# EasyEDA Pro project XIAO Board.eprj

# Schematic Schematic1
Board Name: Board1; Create Date: 2026-01-22; Page Name: P1; Project Name: XIAO Board; Schematic Name: Schematic1; Update Date: 2026-01-22; Company: EasyEDA.com; Page Size: A4; Version: V1.0
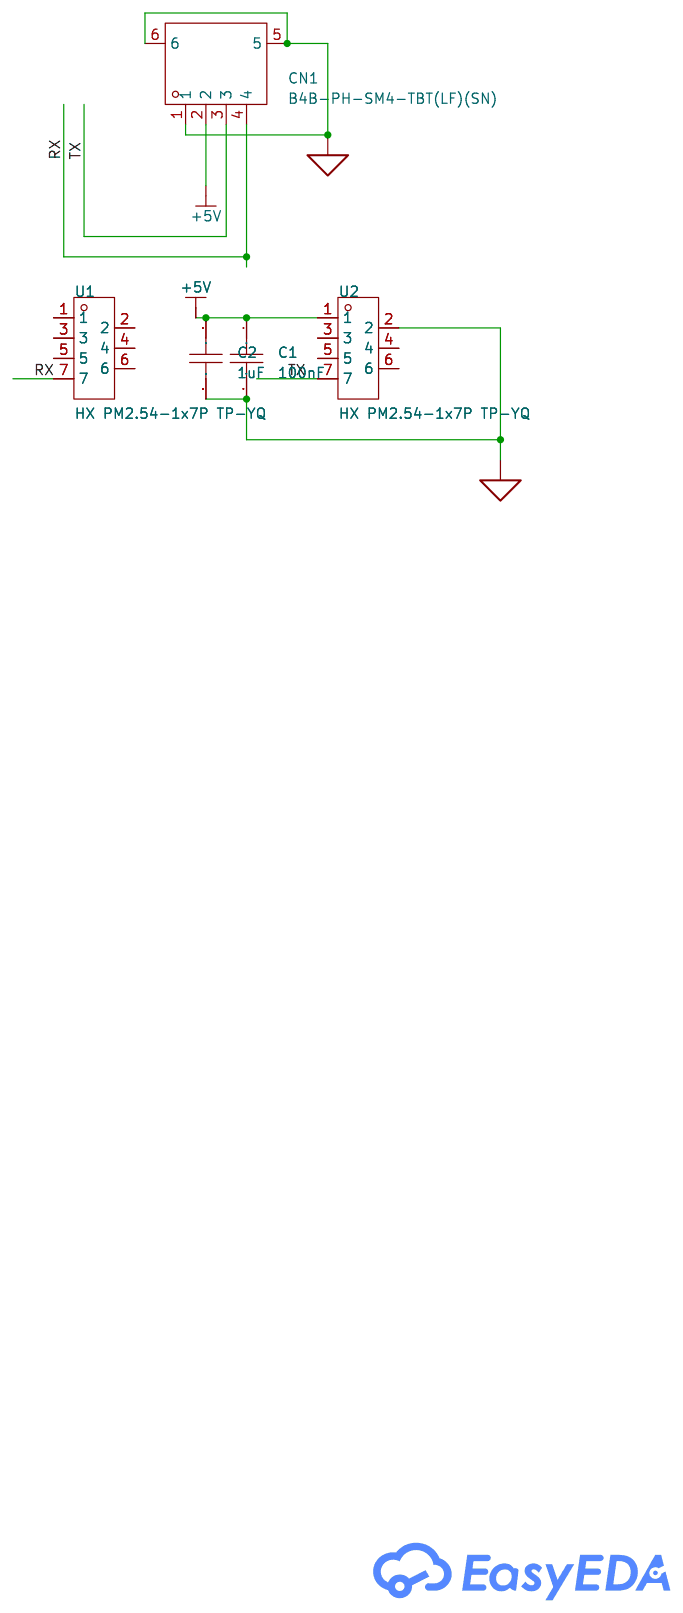
[diagram p0: schematic sheet]

## Parts
C1  100nF  [C0603]
C2  1uF  [C0603]
CN1  B4B-PH-SM4-TBT(LF)(SN)  [CONN-SMD_B4B-PH-SM4-TBT-LF-SN]
U1  HX PM2.54-1x7P TP-YQ  [HDR-SMD_7P-P2.54_HX-PM2.54-1X7P-TP-YQ]
U2  HX PM2.54-1x7P TP-YQ  [HDR-SMD_7P-P2.54_HX-PM2.54-1X7P-TP-YQ]

## Library data of the parts
C1 = CL10B104KB8NNNC: Capacitance:100nF Tolerance:±10% Tolerance:±10% Voltage Rating:50V Temperature Coefficient:X7R; LCSC Part Name: 100nF ±10% 50V; Supplier Part: C1591; Manufacturer: SAMSUNG(三星); Supplier Footprint: 0603; JLCPCB Part Class: Extended Part; Datasheet: https://item.szlcsc.com/datasheet/CL10B104KB8NNNC/1943.html; Supplier: LCSC; Tolerance: ±10%; Voltage Rating: 50V; Temperature Coefficient: X7R
C2 = CGA0603X5R105K500JT: Capacitance:1uF Tolerance:±10% Tolerance:±10% Voltage Rating:50V Temperature Coefficient:X5R; LCSC Part Name: 1uF ±10% 50V; Supplier Part: C6119852; Manufacturer: HRE(芯声); Supplier Footprint: 0603; JLCPCB Part Class: Extended Part; Datasheet: https://item.szlcsc.com/datasheet/CGA0603X5R105K500JT/7062558.html; Supplier: LCSC; Tolerance: ±10%; Voltage Rating: 50V; Temperature Coefficient: X5R
CN1 = B4B-PH-SM4-TBT(LF)(SN): LCSC Part Name: 1x4P 间距:2mm 立贴 系列:PH; Supplier Part: C265116; Manufacturer: JST; Supplier Footprint: SMD,P=2mm; JLCPCB Part Class: Extended Part; Datasheet: https://item.szlcsc.com/datasheet/B4B-PH-SM4-TBT(LF)(SN)/255487.html; Supplier: LCSC; Pins Structure: 1x4P; Pitch: 2mm; Mounting Type: Surface Mount,Vertical; Reference Series: PH; Number of Pins: 4P; Number of Rows: 1; Number of PINs Per Row: 4; Current Rating: 2A; Contact Material: Copper Alloy; Contact Plating: Tin; Operating Temperature: -25℃~+85℃; Voltage Rating: 100V; Plastic Material: PA; Flame Retardant Rating: UL94V-0; Supplementary Features: Auxiliary Solder Pin; Color: Beige; Z-Height of the Board: 6.6mm; X-Length of Bottom Edge on Board (Spacing Line): 11.95mm; Y-Width of Bottom Edge on Board: 7mm
U1 U2 = HX PM2.54-1x7P TP-YQ: LCSC Part Name: 1x7P 间距:2.54mm 立贴; Supplier Part: C42379199; Manufacturer: hanxia(韩下); Supplier Footprint: SMD,P=2.54mm(交错脚); JLCPCB Part Class: Extended Part; Datasheet: https://item.szlcsc.com/datasheet/HX%2520PM2.54-1x7P%2520TP-YQ/44285228.html; Supplier: LCSC; Holes Structure: 1x7P; Pitch: 2.54mm; Circular Hole / Square Hole: Square Hole; Mounting Type: Surface Mount,Vertical; Number of Rows: 1; Number of Positions: 7P; Current Rating: 3A; Voltage Rating (Max): 1kV; Holes Direction: Top; Insulation Height: 5mm; Contact Material: Brass; Contact Plating: Gold; Operating Temperature: -40℃~+105℃

## Nets
+5V: C1.1 C2.1 CN1.2 U2.1
GND: C1.2 C2.2 CN1.1 CN1.5 CN1.6 U2.2
RX: CN1.4 U1.7
TX: CN1.3 U2.7

Not connected (* = marked no-connect by the designer): U1 1 2 3 4 5 6; U2 3 4 5 6

# Board PCB1
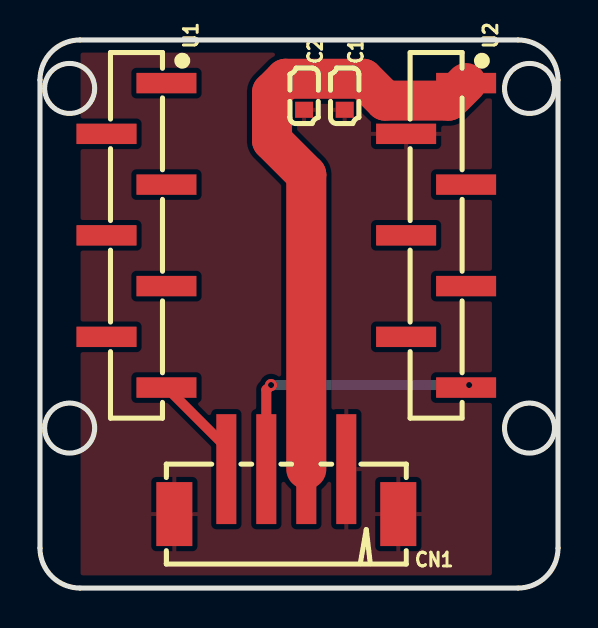
[diagram p1: board, top side]
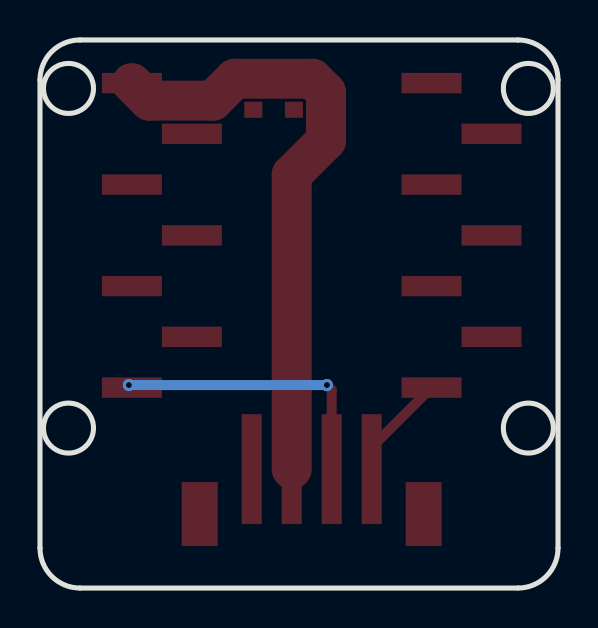
[diagram p2: board, bottom side, seen from below]

Outline 25.91 x 27.43 mm; copper layers: Top Layer, Bottom Layer. Coordinates in mm from the lower left corner of the outline.
Outline path: circle c1.48,25.01 r1.25 ; circle c1.48,8.01 r1.25 ; circle c24.48,25.01 r1.25 ; circle c24.48,8.01 r1.25 ; 0,25.43 0,2 arc(0.59,0.59) 2,0 23.91,0 arc(25.32,0.59) 25.91,2 25.91,25.43 arc(25.32,26.85) 23.91,27.43 2,27.43 arc(0.59,26.85) 0,25.43
Stack: Top Layer 0.035mm / Dielectric1 1.51mm FR4 er 4.5 / Bottom Layer 0.035mm

## Design rules (mm)
template: JLCPCB Capability(Two Layers Board)
spacing copperThickness1oz (default): track to track 0.102, other pairs 0.152 to 0.3
spacing copperThickness2oz: track to track 0.203, other pairs 0.152 to 0.3
track width copperThickness1oz (default): min 0.127, default 0.254, max 2.54
track width copperThickness2oz: min 0.203, default 0.254, max 2.54
differential pair differentialPair (default): width min 0.127, default 0.254, max 2.54; gap min 0.152, default 0.152
via viaSize (default): diameter min 0.5, default 0.61, max 10; hole min 0.3, default 0.305, max 6.3

## Placement (name value [footprint] x y rotation side)
C1  100nF  [C0603]  15.24 24.64 270 top
C2  1uF  [C0603]  13.21 24.64 270 top
CN1  B4B-PH-SM4-TBT(LF)(SN)  [CONN-SMD_B4B-PH-SM4-TBT-LF-SN]  12.32 4.83 180 top
U1  HX PM2.54-1x7P TP-YQ  [HDR-SMD_7P-P2.54_HX-PM2.54-1X7P-TP-YQ]  4.83 17.65 270 top
U2  HX PM2.54-1x7P TP-YQ  [HDR-SMD_7P-P2.54_HX-PM2.54-1X7P-TP-YQ]  19.81 17.65 270 top

## Footprints (pads in the part's own frame, mm; a bottom-side part is the same pattern mirrored in y, then rotated)
C0603
  rect 0.8x0.9 smd: 1(-0.7,0) 2(0.7,0)
CONN-SMD_B4B-PH-SM4-TBT-LF-SN
  rect 1x5.5 smd: 1(-3,-1.125) 2(-1,-1.125) 3(1,-1.125) 4(3,-1.125)
  rect 1.8x3.2 smd: 5(5.6,1.125) 6(-5.6,1.125)
HDR-SMD_7P-P2.54_HX-PM2.54-1X7P-TP-YQ
  rect 1.02x3 smd: 1(-7.62,1.5) 2(-5.08,-1.5) 3(-2.54,1.5) 4(0,-1.5) 5(2.54,1.5) 6(5.08,-1.5) 7(7.62,1.5)

## Nets
As in the schematic.

Pads without a net: U1 1 2 3 4 5 6; U2 3 4 5 6

## Via types
v1: diameter 0.61, hole 0.305, Top Layer to Bottom Layer, 2 vias

## Routing (per net, layer and track width the routed paths; a pad name or vN(x,y) marks a point on that pad's centre or on a via; arc(x,y) is an arc through that point)
+5V: length 30.4
  Top Layer w2: U2.1 20.43,24.39 17.26,24.39 16.17,25.49 12.28,25.49 11.61,24.81 11.61,22.4 13.32,20.69 CN1.2
RX: length 5.3
  Top Layer w0.5: CN1.4 9.32,7.04 U1.7
TX: length 14.2
  Top Layer w0.5: v1(11.56,10.16) 11.32,9.92 CN1.3
  Bottom Layer w0.5: v1(11.56,10.16) v1(21.46,10.16)

## Copper pours and planes (outline as drawn; the poured copper is in the pictures)
GND on Top Layer: 2.03,26.8 22.61,26.8 22.61,0.64 2.03,0.64
GND on Bottom Layer: 2.03,26.67 22.61,26.67 22.61,0.64 2.03,0.64
